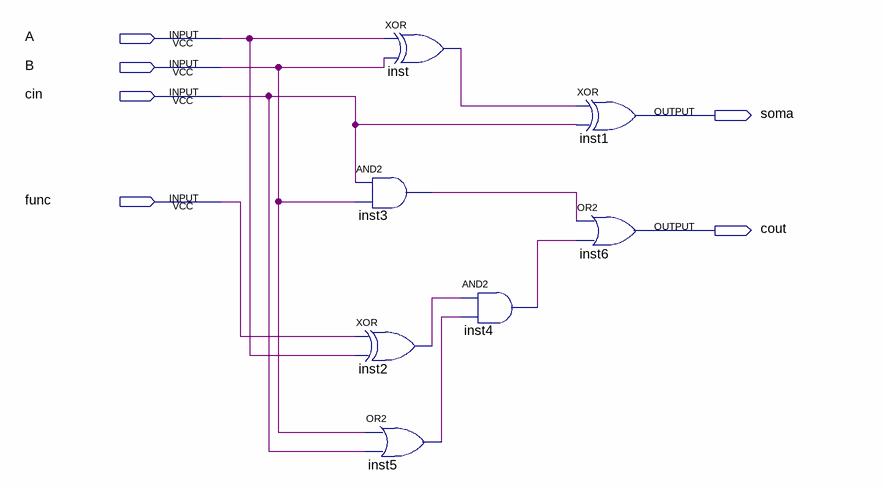
[diagram p0: schematic sheet]
// Quartus schematic teste.bdf as structural Verilog: 7 symbols, 6 pins
module teste (
  input  A,
  input  B,
  input  cin,
  input  func,
  output soma,
  output cout
);

  wire inst2_out, inst3_out, inst4_out, inst5_out, inst_out;

  xor inst (inst_out, A, B);
  and inst3 (inst3_out, cin, B);
  xor inst2 (inst2_out, func, A);
  or inst5 (inst5_out, B, cin);
  and inst4 (inst4_out, inst2_out, inst5_out);
  xor inst1 (soma, inst_out, cin);
  or inst6 (cout, inst3_out, inst4_out);
endmodule
